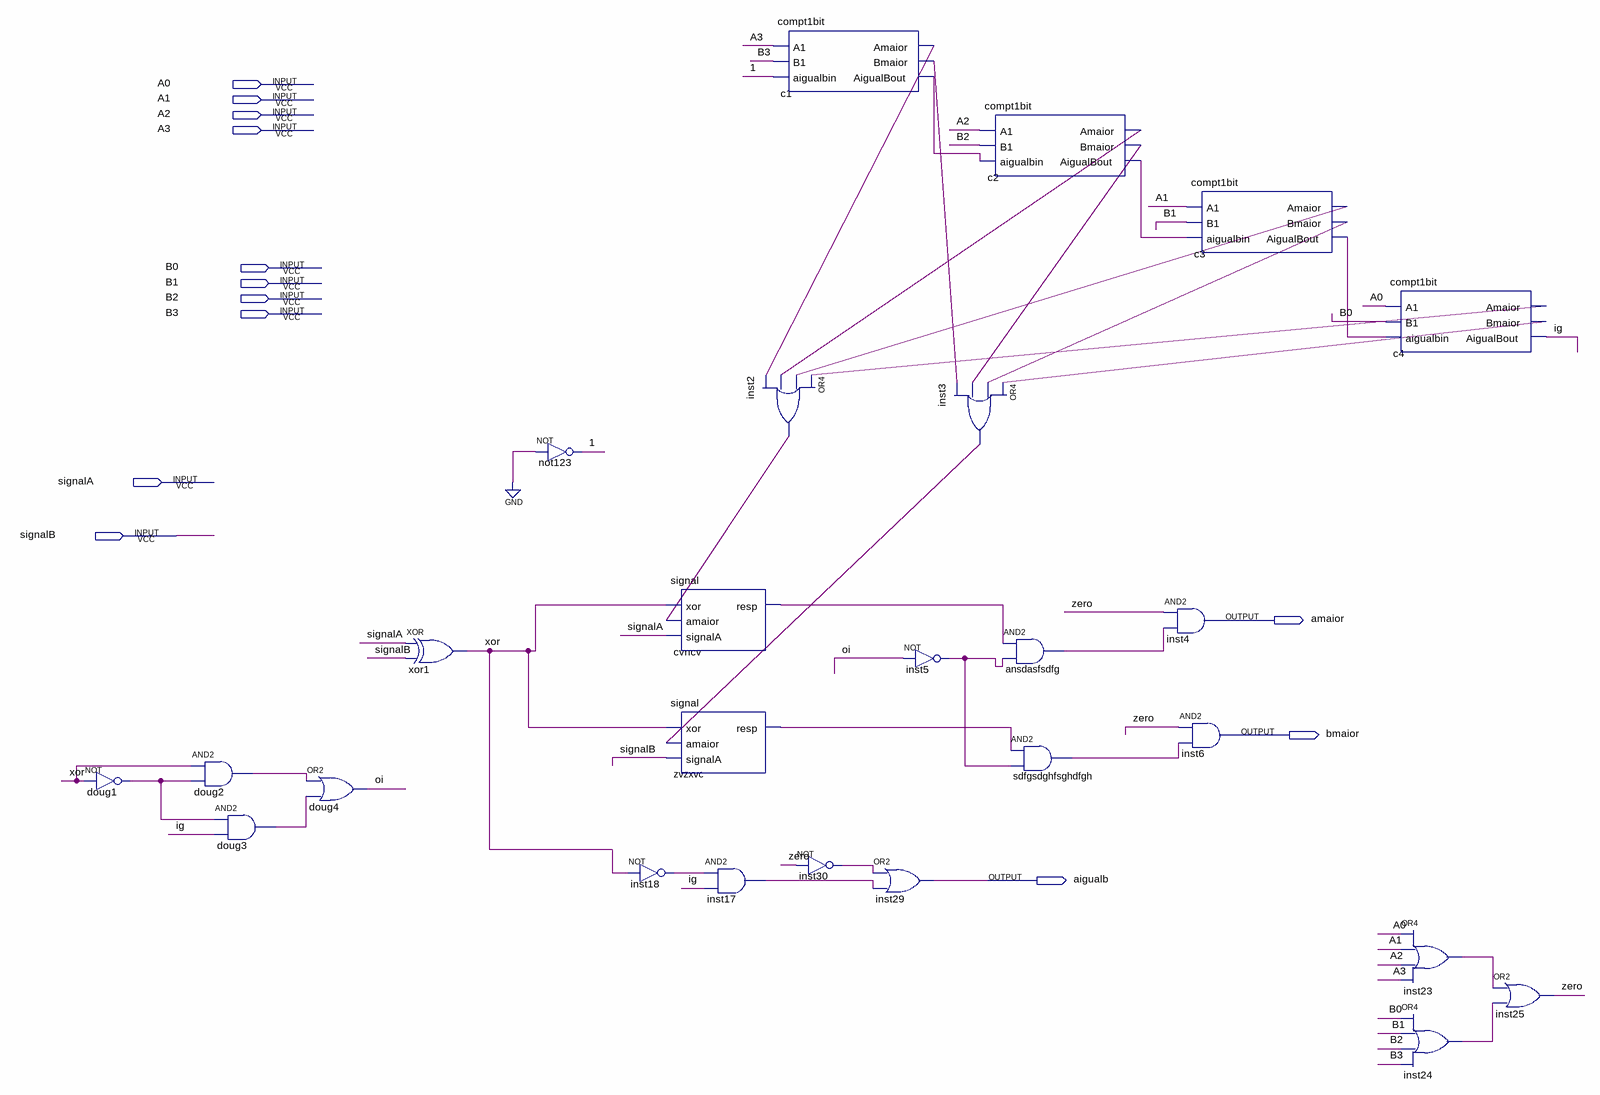
[diagram p0: schematic sheet]
// Quartus schematic comparador.bdf as structural Verilog: 26 symbols, 13 pins
module comparador (
  input  A0,
  input  A1,
  input  A2,
  input  A3,
  input  B0,
  input  B1,
  input  B2,
  input  B3,
  input  signalA,
  input  signalB,
  output amaior,
  output bmaior,
  output aigualb
);

  wire \1 , ansdasfsdfg_out, c1_aigualbout, c1_amaior, c1_bmaior, c2_aigualbout, c2_amaior, c2_bmaior,
       c3_aigualbout, c3_amaior, c3_bmaior, c4_amaior, c4_bmaior, cvncv_resp, doug1_out, doug2_out,
       doug3_out, ig, inst2_out, inst3_out, inst5_out, inst17_out, inst18_out, inst23_out, inst24_out,
       inst30_out, oi, sdfgsdghfsghdfgh_out, \xor , zero, zvzxvc_resp;

  not doug1 (doug1_out, \xor );
  and doug2 (doug2_out, \xor , doug1_out);
  and doug3 (doug3_out, doug1_out, ig);
  or doug4 (oi, doug2_out, doug3_out);
  xor xor1 (\xor , signalA, signalB);
  not not123 (\1 , 1'b0);
  not inst18 (inst18_out, \xor );
  signal cvncv (.\xor (\xor ), .amaior(inst2_out), .signalA(signalA), .resp(cvncv_resp));
  signal zvzxvc (.\xor (\xor ), .amaior(inst3_out), .signalA(signalB), .resp(zvzxvc_resp));
  or inst2 (inst2_out, c4_amaior, c3_amaior, c2_amaior, c1_amaior);
  and inst17 (inst17_out, inst18_out, ig);
  compt1bit c1 (.A1(A3), .B1(B3), .aigualbin(\1 ), .Amaior(c1_amaior), .Bmaior(c1_bmaior), .AigualBout(c1_aigualbout));
  not inst30 (inst30_out, zero);
  or inst29 (aigualb, inst30_out, inst17_out);
  not inst5 (inst5_out, oi);
  compt1bit c2 (
    .A1(A2), .B1(B2), .aigualbin(c1_aigualbout), .Amaior(c2_amaior), .Bmaior(c2_bmaior),
    .AigualBout(c2_aigualbout));
  or inst3 (inst3_out, c4_bmaior, c3_bmaior, c2_bmaior, c1_bmaior);
  and ansdasfsdfg (ansdasfsdfg_out, cvncv_resp, inst5_out);
  and sdfgsdghfsghdfgh (sdfgsdghfsghdfgh_out, zvzxvc_resp, inst5_out);
  and inst4 (amaior, zero, ansdasfsdfg_out);
  and inst6 (bmaior, zero, sdfgsdghfsghdfgh_out);
  compt1bit c3 (
    .A1(A1), .B1(B1), .aigualbin(c2_aigualbout), .Amaior(c3_amaior), .Bmaior(c3_bmaior),
    .AigualBout(c3_aigualbout));
  compt1bit c4 (.A1(A0), .B1(B0), .aigualbin(c3_aigualbout), .Amaior(c4_amaior), .Bmaior(c4_bmaior), .AigualBout(ig));
  or inst23 (inst23_out, A0, A1, A2, A3);
  or inst24 (inst24_out, B0, B1, B2, B3);
  or inst25 (zero, inst23_out, inst24_out);
endmodule
